# Altium project FlexLED.PrjPcb
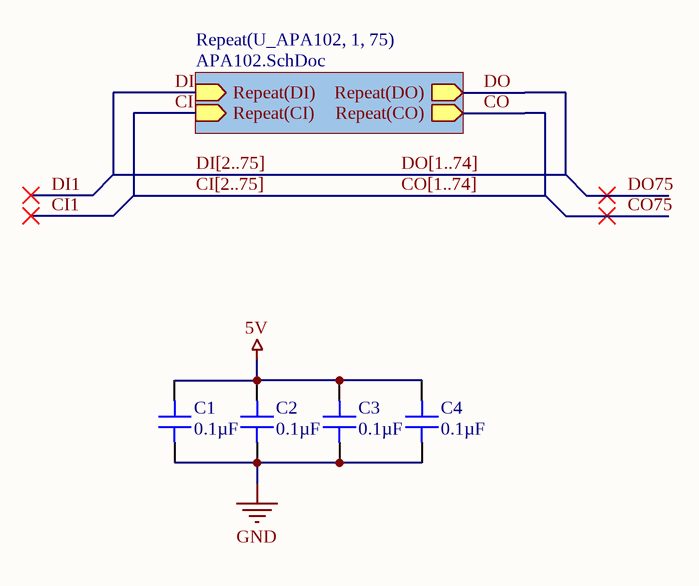
[diagram p0: top.SchDoc]
2 sheets, 79 parts. Net scope: hierarchical (ports join the sheet entries above them; power ports are global).
Board file: FlexLED.PcbDoc
Sheets:
  top.SchDoc
    U_APA1021 = APA102.SchDoc
    U_APA1022 = APA102.SchDoc
    U_APA1023 = APA102.SchDoc
    U_APA1024 = APA102.SchDoc
    U_APA1025 = APA102.SchDoc
    U_APA1026 = APA102.SchDoc
    U_APA1027 = APA102.SchDoc
    U_APA1028 = APA102.SchDoc
    U_APA1029 = APA102.SchDoc
    U_APA10210 = APA102.SchDoc
    U_APA10211 = APA102.SchDoc
    U_APA10212 = APA102.SchDoc
    U_APA10213 = APA102.SchDoc
    U_APA10214 = APA102.SchDoc
    U_APA10215 = APA102.SchDoc
    U_APA10216 = APA102.SchDoc
    U_APA10217 = APA102.SchDoc
    U_APA10218 = APA102.SchDoc
    U_APA10219 = APA102.SchDoc
    U_APA10220 = APA102.SchDoc
    U_APA10221 = APA102.SchDoc
    U_APA10222 = APA102.SchDoc
    U_APA10223 = APA102.SchDoc
    U_APA10224 = APA102.SchDoc
    U_APA10225 = APA102.SchDoc
    U_APA10226 = APA102.SchDoc
    U_APA10227 = APA102.SchDoc
    U_APA10228 = APA102.SchDoc
    U_APA10229 = APA102.SchDoc
    U_APA10230 = APA102.SchDoc
    U_APA10231 = APA102.SchDoc
    U_APA10232 = APA102.SchDoc
    U_APA10233 = APA102.SchDoc
    U_APA10234 = APA102.SchDoc
    U_APA10235 = APA102.SchDoc
    U_APA10236 = APA102.SchDoc
    U_APA10237 = APA102.SchDoc
    U_APA10238 = APA102.SchDoc
    U_APA10239 = APA102.SchDoc
    U_APA10240 = APA102.SchDoc
    U_APA10241 = APA102.SchDoc
    U_APA10242 = APA102.SchDoc
    U_APA10243 = APA102.SchDoc
    U_APA10244 = APA102.SchDoc
    U_APA10245 = APA102.SchDoc
    U_APA10246 = APA102.SchDoc
    U_APA10247 = APA102.SchDoc
    U_APA10248 = APA102.SchDoc
    U_APA10249 = APA102.SchDoc
    U_APA10250 = APA102.SchDoc
    U_APA10251 = APA102.SchDoc
    U_APA10252 = APA102.SchDoc
    U_APA10253 = APA102.SchDoc
    U_APA10254 = APA102.SchDoc
    U_APA10255 = APA102.SchDoc
    U_APA10256 = APA102.SchDoc
    U_APA10257 = APA102.SchDoc
    U_APA10258 = APA102.SchDoc
    U_APA10259 = APA102.SchDoc
    U_APA10260 = APA102.SchDoc
    U_APA10261 = APA102.SchDoc
    U_APA10262 = APA102.SchDoc
    U_APA10263 = APA102.SchDoc
    U_APA10264 = APA102.SchDoc
    U_APA10265 = APA102.SchDoc
    U_APA10266 = APA102.SchDoc
    U_APA10267 = APA102.SchDoc
    U_APA10268 = APA102.SchDoc
    U_APA10269 = APA102.SchDoc
    U_APA10270 = APA102.SchDoc
    U_APA10271 = APA102.SchDoc
    U_APA10272 = APA102.SchDoc
    U_APA10273 = APA102.SchDoc
    U_APA10274 = APA102.SchDoc
    U_APA10275 = APA102.SchDoc

## Sheet top.SchDoc
size A

### Parts
C1  0.1µF  [CAP 0402_1005]
C2  0.1µF  [CAP 0402_1005]
C3  0.1µF  [CAP 0402_1005]
C4  0.1µF  [CAP 0402_1005]

### Sub-sheets
Repeat(U_APA102, 1, 75) = APA102.SchDoc: Repeat(DI) (in), Repeat(CI) (in), Repeat(CO) (out), Repeat(DO) (out)

### Nets
5V: C1.2 C2.2 C3.2 C4.2
GND: C1.1 C2.1 C3.1 C4.1
CI: sheet Repeat(U_APA102, 1, 75)/Repeat(CI)
CO: sheet Repeat(U_APA102, 1, 75)/Repeat(CO)
DI: sheet Repeat(U_APA102, 1, 75)/Repeat(DI)
DO: sheet Repeat(U_APA102, 1, 75)/Repeat(DO)

### Buses and harness runs
bus CI[2..75] = CO[1..74]
bus DI[2..75] = DO[1..74]

### Library data of the parts
C1-C4 = VJ0402V104ZXJCW1BC: CAP CER 0.1UF 16V Y5V 0402; Manufacturer: Vishay Vitramon; Temperature Coefficient: Y5V (F); Tolerance: -20%, +80%; Part Number: VJ0402V104ZXJCW1BC; Value: 0.1µF; Applications: General Purpose; Capacitance: 0.1µF; ComponentLink1Description: Datasheet; ComponentLink1URL: https://www.vishay.com/docs/28548/vjw1bcbascomseries.pdf; ComponentLink2Description: DigiKey Link; ComponentLink2URL: http://digikey.com/product-detail/en/vishay-vitramon/VJ0402V104ZXJCW1BC/720-1523-1-ND/420979; Device Package: 0402 (1005 Metric); LastUpdated: 9/2/2020 1:01:27 AM; Lifecycle Status: Active; Minimum Order: 1; Mounting Type: Surface Mount, MLCC; Operating Temperature: -30°C ~ 85°C; Package / Case: 0402 (1005 Metric); Packaging: TapeAndReel; PartId: 12979; Part Status: Active; Price: 0.01; Series: VJ; Size / Dimension: 0.039" L x 0.020" W (1.00mm x 0.50mm); Supplier 1: DigiKey; Supplier Part Number 1: 720-1523-1-ND; Thickness (Max): 0.022" (0.55mm); Voltage - Rated: 16V

## Sheet APA102.SchDoc
size A
Used 75 times, as channels U_APA1021, U_APA1022, U_APA1023, U_APA1024, U_APA1025, U_APA1026, U_APA1027, U_APA1028, U_APA1029, U_APA10210, U_APA10211, U_APA10212, U_APA10213, U_APA10214, U_APA10215, U_APA10216, U_APA10217, U_APA10218, U_APA10219, U_APA10220, U_APA10221, U_APA10222, U_APA10223, U_APA10224, U_APA10225, U_APA10226, U_APA10227, U_APA10228, U_APA10229, U_APA10230, U_APA10231, U_APA10232, U_APA10233, U_APA10234, U_APA10235, U_APA10236, U_APA10237, U_APA10238, U_APA10239, U_APA10240, U_APA10241, U_APA10242, U_APA10243, U_APA10244, U_APA10245, U_APA10246, U_APA10247, U_APA10248, U_APA10249, U_APA10250, U_APA10251, U_APA10252, U_APA10253, U_APA10254, U_APA10255, U_APA10256, U_APA10257, U_APA10258, U_APA10259, U_APA10260, U_APA10261, U_APA10262, U_APA10263, U_APA10264, U_APA10265, U_APA10266, U_APA10267, U_APA10268, U_APA10269, U_APA10270, U_APA10271, U_APA10272, U_APA10273, U_APA10274, U_APA10275. Parts and nets are listed once, with the designators drawn on the sheet.
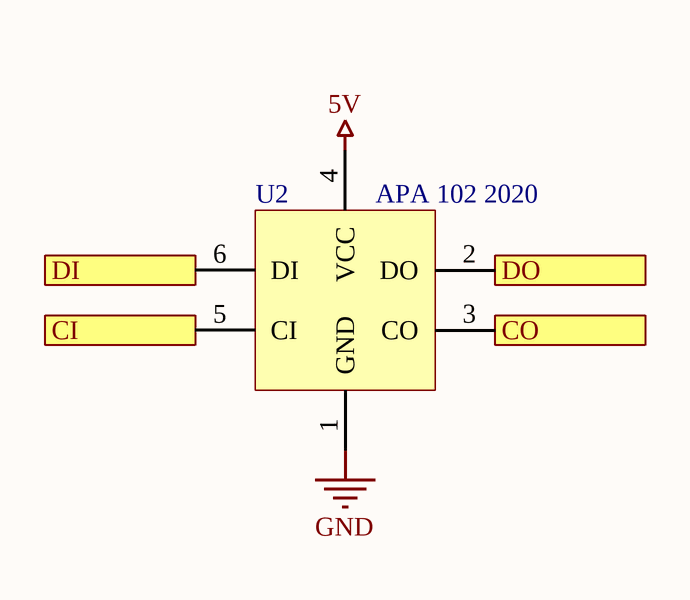
[diagram p1: APA102.SchDoc]

### Parts
U2  APA 102 2020  [LED_APA-102-1515]

### Ports
CI (in), CO (out), DI (in), DO (out)

### Nets
5V: U2.4(VCC)
GND: U2.1(GND)
CI: U2.5(CI) ; port CI
CO: U2.3(CO) ; port CO
DI: U2.6(DI) ; port DI
DO: U2.2(DO) ; port DO

### Channels
U_APA1021: designators end in _1; ports CI=CI1 CO=CI2 DI=DI1 DO=DI2
U_APA1022: designators end in _2; ports CI=CI2 CO=CI3 DI=DI2 DO=DI3
U_APA1023: designators end in _3; ports CI=CI3 CO=CI4 DI=DI3 DO=DI4
U_APA1024: designators end in _4; ports CI=CI4 CO=CI5 DI=DI4 DO=DI5
U_APA1025: designators end in _5; ports CI=CI5 CO=CI6 DI=DI5 DO=DI6
U_APA1026: designators end in _6; ports CI=CI6 CO=CI7 DI=DI6 DO=DI7
U_APA1027: designators end in _7; ports CI=CI7 CO=CI8 DI=DI7 DO=DI8
U_APA1028: designators end in _8; ports CI=CI8 CO=CI9 DI=DI8 DO=DI9
U_APA1029: designators end in _9; ports CI=CI9 CO=CI10 DI=DI9 DO=DI10
U_APA10210: designators end in _10; ports CI=CI10 CO=CI11 DI=DI10 DO=DI11
U_APA10211: designators end in _11; ports CI=CI11 CO=CI12 DI=DI11 DO=DI12
U_APA10212: designators end in _12; ports CI=CI12 CO=CI13 DI=DI12 DO=DI13
U_APA10213: designators end in _13; ports CI=CI13 CO=CI14 DI=DI13 DO=DI14
U_APA10214: designators end in _14; ports CI=CI14 CO=CI15 DI=DI14 DO=DI15
U_APA10215: designators end in _15; ports CI=CI15 CO=CI16 DI=DI15 DO=DI16
U_APA10216: designators end in _16; ports CI=CI16 CO=CI17 DI=DI16 DO=DI17
U_APA10217: designators end in _17; ports CI=CI17 CO=CI18 DI=DI17 DO=DI18
U_APA10218: designators end in _18; ports CI=CI18 CO=CI19 DI=DI18 DO=DI19
U_APA10219: designators end in _19; ports CI=CI19 CO=CI20 DI=DI19 DO=DI20
U_APA10220: designators end in _20; ports CI=CI20 CO=CI21 DI=DI20 DO=DI21
U_APA10221: designators end in _21; ports CI=CI21 CO=CI22 DI=DI21 DO=DI22
U_APA10222: designators end in _22; ports CI=CI22 CO=CI23 DI=DI22 DO=DI23
U_APA10223: designators end in _23; ports CI=CI23 CO=CI24 DI=DI23 DO=DI24
U_APA10224: designators end in _24; ports CI=CI24 CO=CI25 DI=DI24 DO=DI25
U_APA10225: designators end in _25; ports CI=CI25 CO=CI26 DI=DI25 DO=DI26
U_APA10226: designators end in _26; ports CI=CI26 CO=CI27 DI=DI26 DO=DI27
U_APA10227: designators end in _27; ports CI=CI27 CO=CI28 DI=DI27 DO=DI28
U_APA10228: designators end in _28; ports CI=CI28 CO=CI29 DI=DI28 DO=DI29
U_APA10229: designators end in _29; ports CI=CI29 CO=CI30 DI=DI29 DO=DI30
U_APA10230: designators end in _30; ports CI=CI30 CO=CI31 DI=DI30 DO=DI31
U_APA10231: designators end in _31; ports CI=CI31 CO=CI32 DI=DI31 DO=DI32
U_APA10232: designators end in _32; ports CI=CI32 CO=CI33 DI=DI32 DO=DI33
U_APA10233: designators end in _33; ports CI=CI33 CO=CI34 DI=DI33 DO=DI34
U_APA10234: designators end in _34; ports CI=CI34 CO=CI35 DI=DI34 DO=DI35
U_APA10235: designators end in _35; ports CI=CI35 CO=CI36 DI=DI35 DO=DI36
U_APA10236: designators end in _36; ports CI=CI36 CO=CI37 DI=DI36 DO=DI37
U_APA10237: designators end in _37; ports CI=CI37 CO=CI38 DI=DI37 DO=DI38
U_APA10238: designators end in _38; ports CI=CI38 CO=CI39 DI=DI38 DO=DI39
U_APA10239: designators end in _39; ports CI=CI39 CO=CI40 DI=DI39 DO=DI40
U_APA10240: designators end in _40; ports CI=CI40 CO=CI41 DI=DI40 DO=DI41
U_APA10241: designators end in _41; ports CI=CI41 CO=CI42 DI=DI41 DO=DI42
U_APA10242: designators end in _42; ports CI=CI42 CO=CI43 DI=DI42 DO=DI43
U_APA10243: designators end in _43; ports CI=CI43 CO=CI44 DI=DI43 DO=DI44
U_APA10244: designators end in _44; ports CI=CI44 CO=CI45 DI=DI44 DO=DI45
U_APA10245: designators end in _45; ports CI=CI45 CO=CI46 DI=DI45 DO=DI46
U_APA10246: designators end in _46; ports CI=CI46 CO=CI47 DI=DI46 DO=DI47
U_APA10247: designators end in _47; ports CI=CI47 CO=CI48 DI=DI47 DO=DI48
U_APA10248: designators end in _48; ports CI=CI48 CO=CI49 DI=DI48 DO=DI49
U_APA10249: designators end in _49; ports CI=CI49 CO=CI50 DI=DI49 DO=DI50
U_APA10250: designators end in _50; ports CI=CI50 CO=CI51 DI=DI50 DO=DI51
U_APA10251: designators end in _51; ports CI=CI51 CO=CI52 DI=DI51 DO=DI52
U_APA10252: designators end in _52; ports CI=CI52 CO=CI53 DI=DI52 DO=DI53
U_APA10253: designators end in _53; ports CI=CI53 CO=CI54 DI=DI53 DO=DI54
U_APA10254: designators end in _54; ports CI=CI54 CO=CI55 DI=DI54 DO=DI55
U_APA10255: designators end in _55; ports CI=CI55 CO=CI56 DI=DI55 DO=DI56
U_APA10256: designators end in _56; ports CI=CI56 CO=CI57 DI=DI56 DO=DI57
U_APA10257: designators end in _57; ports CI=CI57 CO=CI58 DI=DI57 DO=DI58
U_APA10258: designators end in _58; ports CI=CI58 CO=CI59 DI=DI58 DO=DI59
U_APA10259: designators end in _59; ports CI=CI59 CO=CI60 DI=DI59 DO=DI60
U_APA10260: designators end in _60; ports CI=CI60 CO=CI61 DI=DI60 DO=DI61
U_APA10261: designators end in _61; ports CI=CI61 CO=CI62 DI=DI61 DO=DI62
U_APA10262: designators end in _62; ports CI=CI62 CO=CI63 DI=DI62 DO=DI63
U_APA10263: designators end in _63; ports CI=CI63 CO=CI64 DI=DI63 DO=DI64
U_APA10264: designators end in _64; ports CI=CI64 CO=CI65 DI=DI64 DO=DI65
U_APA10265: designators end in _65; ports CI=CI65 CO=CI66 DI=DI65 DO=DI66
U_APA10266: designators end in _66; ports CI=CI66 CO=CI67 DI=DI66 DO=DI67
U_APA10267: designators end in _67; ports CI=CI67 CO=CI68 DI=DI67 DO=DI68
U_APA10268: designators end in _68; ports CI=CI68 CO=CI69 DI=DI68 DO=DI69
U_APA10269: designators end in _69; ports CI=CI69 CO=CI70 DI=DI69 DO=DI70
U_APA10270: designators end in _70; ports CI=CI70 CO=CI71 DI=DI70 DO=DI71
U_APA10271: designators end in _71; ports CI=CI71 CO=CI72 DI=DI71 DO=DI72
U_APA10272: designators end in _72; ports CI=CI72 CO=CI73 DI=DI72 DO=DI73
U_APA10273: designators end in _73; ports CI=CI73 CO=CI74 DI=DI73 DO=DI74
U_APA10274: designators end in _74; ports CI=CI74 CO=CI75 DI=DI74 DO=DI75
U_APA10275: designators end in _75; ports CI=CI75 CO=CO75 DI=DI75 DO=DO75

### Library data of the parts
U2 = APA-102-1515: 8-pin type LED three-color RGB Dimming control; MP: APA-102-2020-256-8; MF: iPixel LED Light Co.; Value: *; SnapEDA_Link: https://www.snapeda.com/parts/APA-102-2020-256-8/iPixel%20LED%20Light%20Co./view-part/698331/?ref=snap; Availability: Unavailable; Package: SMD-8 iPixel LED Light Co.; Price: None

## Nets that join several sheets
5V: top (C1.2 C2.2 C3.2 C4.2), U_APA1021 (U2_1.4), U_APA1022 (U2_2.4), U_APA1023 (U2_3.4), U_APA1024 (U2_4.4), U_APA1025 (U2_5.4), U_APA1026 (U2_6.4), U_APA1027 (U2_7.4), U_APA1028 (U2_8.4), U_APA1029 (U2_9.4), U_APA10210 (U2_10.4), U_APA10211 (U2_11.4), U_APA10212 (U2_12.4), U_APA10213 (U2_13.4), U_APA10214 (U2_14.4), U_APA10215 (U2_15.4), U_APA10216 (U2_16.4), U_APA10217 (U2_17.4), U_APA10218 (U2_18.4), U_APA10219 (U2_19.4), U_APA10220 (U2_20.4), U_APA10221 (U2_21.4), U_APA10222 (U2_22.4), U_APA10223 (U2_23.4), U_APA10224 (U2_24.4), U_APA10225 (U2_25.4), U_APA10226 (U2_26.4), U_APA10227 (U2_27.4), U_APA10228 (U2_28.4), U_APA10229 (U2_29.4), U_APA10230 (U2_30.4), U_APA10231 (U2_31.4), U_APA10232 (U2_32.4), U_APA10233 (U2_33.4), U_APA10234 (U2_34.4), U_APA10235 (U2_35.4), U_APA10236 (U2_36.4), U_APA10237 (U2_37.4), U_APA10238 (U2_38.4), U_APA10239 (U2_39.4), U_APA10240 (U2_40.4), U_APA10241 (U2_41.4), U_APA10242 (U2_42.4), U_APA10243 (U2_43.4), U_APA10244 (U2_44.4), U_APA10245 (U2_45.4), U_APA10246 (U2_46.4), U_APA10247 (U2_47.4), U_APA10248 (U2_48.4), U_APA10249 (U2_49.4), U_APA10250 (U2_50.4), U_APA10251 (U2_51.4), U_APA10252 (U2_52.4), U_APA10253 (U2_53.4), U_APA10254 (U2_54.4), U_APA10255 (U2_55.4), U_APA10256 (U2_56.4), U_APA10257 (U2_57.4), U_APA10258 (U2_58.4), U_APA10259 (U2_59.4), U_APA10260 (U2_60.4), U_APA10261 (U2_61.4), U_APA10262 (U2_62.4), U_APA10263 (U2_63.4), U_APA10264 (U2_64.4), U_APA10265 (U2_65.4), U_APA10266 (U2_66.4), U_APA10267 (U2_67.4), U_APA10268 (U2_68.4), U_APA10269 (U2_69.4), U_APA10270 (U2_70.4), U_APA10271 (U2_71.4), U_APA10272 (U2_72.4), U_APA10273 (U2_73.4), U_APA10274 (U2_74.4), U_APA10275 (U2_75.4)
GND: top (C1.1 C2.1 C3.1 C4.1), U_APA1021 (U2_1.1), U_APA1022 (U2_2.1), U_APA1023 (U2_3.1), U_APA1024 (U2_4.1), U_APA1025 (U2_5.1), U_APA1026 (U2_6.1), U_APA1027 (U2_7.1), U_APA1028 (U2_8.1), U_APA1029 (U2_9.1), U_APA10210 (U2_10.1), U_APA10211 (U2_11.1), U_APA10212 (U2_12.1), U_APA10213 (U2_13.1), U_APA10214 (U2_14.1), U_APA10215 (U2_15.1), U_APA10216 (U2_16.1), U_APA10217 (U2_17.1), U_APA10218 (U2_18.1), U_APA10219 (U2_19.1), U_APA10220 (U2_20.1), U_APA10221 (U2_21.1), U_APA10222 (U2_22.1), U_APA10223 (U2_23.1), U_APA10224 (U2_24.1), U_APA10225 (U2_25.1), U_APA10226 (U2_26.1), U_APA10227 (U2_27.1), U_APA10228 (U2_28.1), U_APA10229 (U2_29.1), U_APA10230 (U2_30.1), U_APA10231 (U2_31.1), U_APA10232 (U2_32.1), U_APA10233 (U2_33.1), U_APA10234 (U2_34.1), U_APA10235 (U2_35.1), U_APA10236 (U2_36.1), U_APA10237 (U2_37.1), U_APA10238 (U2_38.1), U_APA10239 (U2_39.1), U_APA10240 (U2_40.1), U_APA10241 (U2_41.1), U_APA10242 (U2_42.1), U_APA10243 (U2_43.1), U_APA10244 (U2_44.1), U_APA10245 (U2_45.1), U_APA10246 (U2_46.1), U_APA10247 (U2_47.1), U_APA10248 (U2_48.1), U_APA10249 (U2_49.1), U_APA10250 (U2_50.1), U_APA10251 (U2_51.1), U_APA10252 (U2_52.1), U_APA10253 (U2_53.1), U_APA10254 (U2_54.1), U_APA10255 (U2_55.1), U_APA10256 (U2_56.1), U_APA10257 (U2_57.1), U_APA10258 (U2_58.1), U_APA10259 (U2_59.1), U_APA10260 (U2_60.1), U_APA10261 (U2_61.1), U_APA10262 (U2_62.1), U_APA10263 (U2_63.1), U_APA10264 (U2_64.1), U_APA10265 (U2_65.1), U_APA10266 (U2_66.1), U_APA10267 (U2_67.1), U_APA10268 (U2_68.1), U_APA10269 (U2_69.1), U_APA10270 (U2_70.1), U_APA10271 (U2_71.1), U_APA10272 (U2_72.1), U_APA10273 (U2_73.1), U_APA10274 (U2_74.1), U_APA10275 (U2_75.1)
CI2: U_APA1021 (U2_1.3), U_APA1022 (U2_2.5)
CI3: U_APA1022 (U2_2.3), U_APA1023 (U2_3.5)
CI4: U_APA1023 (U2_3.3), U_APA1024 (U2_4.5)
CI5: U_APA1024 (U2_4.3), U_APA1025 (U2_5.5)
CI6: U_APA1025 (U2_5.3), U_APA1026 (U2_6.5)
CI7: U_APA1026 (U2_6.3), U_APA1027 (U2_7.5)
CI8: U_APA1027 (U2_7.3), U_APA1028 (U2_8.5)
CI9: U_APA1028 (U2_8.3), U_APA1029 (U2_9.5)
CI10: U_APA1029 (U2_9.3), U_APA10210 (U2_10.5)
CI11: U_APA10210 (U2_10.3), U_APA10211 (U2_11.5)
CI12: U_APA10211 (U2_11.3), U_APA10212 (U2_12.5)
CI13: U_APA10212 (U2_12.3), U_APA10213 (U2_13.5)
CI14: U_APA10213 (U2_13.3), U_APA10214 (U2_14.5)
CI15: U_APA10214 (U2_14.3), U_APA10215 (U2_15.5)
CI16: U_APA10215 (U2_15.3), U_APA10216 (U2_16.5)
CI17: U_APA10216 (U2_16.3), U_APA10217 (U2_17.5)
CI18: U_APA10217 (U2_17.3), U_APA10218 (U2_18.5)
CI19: U_APA10218 (U2_18.3), U_APA10219 (U2_19.5)
CI20: U_APA10219 (U2_19.3), U_APA10220 (U2_20.5)
CI21: U_APA10220 (U2_20.3), U_APA10221 (U2_21.5)
CI22: U_APA10221 (U2_21.3), U_APA10222 (U2_22.5)
CI23: U_APA10222 (U2_22.3), U_APA10223 (U2_23.5)
CI24: U_APA10223 (U2_23.3), U_APA10224 (U2_24.5)
CI25: U_APA10224 (U2_24.3), U_APA10225 (U2_25.5)
CI26: U_APA10225 (U2_25.3), U_APA10226 (U2_26.5)
CI27: U_APA10226 (U2_26.3), U_APA10227 (U2_27.5)
CI28: U_APA10227 (U2_27.3), U_APA10228 (U2_28.5)
CI29: U_APA10228 (U2_28.3), U_APA10229 (U2_29.5)
CI30: U_APA10229 (U2_29.3), U_APA10230 (U2_30.5)
CI31: U_APA10230 (U2_30.3), U_APA10231 (U2_31.5)
CI32: U_APA10231 (U2_31.3), U_APA10232 (U2_32.5)
CI33: U_APA10232 (U2_32.3), U_APA10233 (U2_33.5)
CI34: U_APA10233 (U2_33.3), U_APA10234 (U2_34.5)
CI35: U_APA10234 (U2_34.3), U_APA10235 (U2_35.5)
CI36: U_APA10235 (U2_35.3), U_APA10236 (U2_36.5)
CI37: U_APA10236 (U2_36.3), U_APA10237 (U2_37.5)
CI38: U_APA10237 (U2_37.3), U_APA10238 (U2_38.5)
CI39: U_APA10238 (U2_38.3), U_APA10239 (U2_39.5)
CI40: U_APA10239 (U2_39.3), U_APA10240 (U2_40.5)
CI41: U_APA10240 (U2_40.3), U_APA10241 (U2_41.5)
CI42: U_APA10241 (U2_41.3), U_APA10242 (U2_42.5)
CI43: U_APA10242 (U2_42.3), U_APA10243 (U2_43.5)
CI44: U_APA10243 (U2_43.3), U_APA10244 (U2_44.5)
CI45: U_APA10244 (U2_44.3), U_APA10245 (U2_45.5)
CI46: U_APA10245 (U2_45.3), U_APA10246 (U2_46.5)
CI47: U_APA10246 (U2_46.3), U_APA10247 (U2_47.5)
CI48: U_APA10247 (U2_47.3), U_APA10248 (U2_48.5)
CI49: U_APA10248 (U2_48.3), U_APA10249 (U2_49.5)
CI50: U_APA10249 (U2_49.3), U_APA10250 (U2_50.5)
CI51: U_APA10250 (U2_50.3), U_APA10251 (U2_51.5)
CI52: U_APA10251 (U2_51.3), U_APA10252 (U2_52.5)
CI53: U_APA10252 (U2_52.3), U_APA10253 (U2_53.5)
CI54: U_APA10253 (U2_53.3), U_APA10254 (U2_54.5)
CI55: U_APA10254 (U2_54.3), U_APA10255 (U2_55.5)
CI56: U_APA10255 (U2_55.3), U_APA10256 (U2_56.5)
CI57: U_APA10256 (U2_56.3), U_APA10257 (U2_57.5)
CI58: U_APA10257 (U2_57.3), U_APA10258 (U2_58.5)
CI59: U_APA10258 (U2_58.3), U_APA10259 (U2_59.5)
CI60: U_APA10259 (U2_59.3), U_APA10260 (U2_60.5)
CI61: U_APA10260 (U2_60.3), U_APA10261 (U2_61.5)
CI62: U_APA10261 (U2_61.3), U_APA10262 (U2_62.5)
CI63: U_APA10262 (U2_62.3), U_APA10263 (U2_63.5)
CI64: U_APA10263 (U2_63.3), U_APA10264 (U2_64.5)
CI65: U_APA10264 (U2_64.3), U_APA10265 (U2_65.5)
CI66: U_APA10265 (U2_65.3), U_APA10266 (U2_66.5)
CI67: U_APA10266 (U2_66.3), U_APA10267 (U2_67.5)
CI68: U_APA10267 (U2_67.3), U_APA10268 (U2_68.5)
CI69: U_APA10268 (U2_68.3), U_APA10269 (U2_69.5)
CI70: U_APA10269 (U2_69.3), U_APA10270 (U2_70.5)
CI71: U_APA10270 (U2_70.3), U_APA10271 (U2_71.5)
CI72: U_APA10271 (U2_71.3), U_APA10272 (U2_72.5)
CI73: U_APA10272 (U2_72.3), U_APA10273 (U2_73.5)
CI74: U_APA10273 (U2_73.3), U_APA10274 (U2_74.5)
CI75: U_APA10274 (U2_74.3), U_APA10275 (U2_75.5)
DI2: U_APA1021 (U2_1.2), U_APA1022 (U2_2.6)
DI3: U_APA1022 (U2_2.2), U_APA1023 (U2_3.6)
DI4: U_APA1023 (U2_3.2), U_APA1024 (U2_4.6)
DI5: U_APA1024 (U2_4.2), U_APA1025 (U2_5.6)
DI6: U_APA1025 (U2_5.2), U_APA1026 (U2_6.6)
DI7: U_APA1026 (U2_6.2), U_APA1027 (U2_7.6)
DI8: U_APA1027 (U2_7.2), U_APA1028 (U2_8.6)
DI9: U_APA1028 (U2_8.2), U_APA1029 (U2_9.6)
DI10: U_APA1029 (U2_9.2), U_APA10210 (U2_10.6)
DI11: U_APA10210 (U2_10.2), U_APA10211 (U2_11.6)
DI12: U_APA10211 (U2_11.2), U_APA10212 (U2_12.6)
DI13: U_APA10212 (U2_12.2), U_APA10213 (U2_13.6)
DI14: U_APA10213 (U2_13.2), U_APA10214 (U2_14.6)
DI15: U_APA10214 (U2_14.2), U_APA10215 (U2_15.6)
DI16: U_APA10215 (U2_15.2), U_APA10216 (U2_16.6)
DI17: U_APA10216 (U2_16.2), U_APA10217 (U2_17.6)
DI18: U_APA10217 (U2_17.2), U_APA10218 (U2_18.6)
DI19: U_APA10218 (U2_18.2), U_APA10219 (U2_19.6)
DI20: U_APA10219 (U2_19.2), U_APA10220 (U2_20.6)
DI21: U_APA10220 (U2_20.2), U_APA10221 (U2_21.6)
DI22: U_APA10221 (U2_21.2), U_APA10222 (U2_22.6)
DI23: U_APA10222 (U2_22.2), U_APA10223 (U2_23.6)
DI24: U_APA10223 (U2_23.2), U_APA10224 (U2_24.6)
DI25: U_APA10224 (U2_24.2), U_APA10225 (U2_25.6)
DI26: U_APA10225 (U2_25.2), U_APA10226 (U2_26.6)
DI27: U_APA10226 (U2_26.2), U_APA10227 (U2_27.6)
DI28: U_APA10227 (U2_27.2), U_APA10228 (U2_28.6)
DI29: U_APA10228 (U2_28.2), U_APA10229 (U2_29.6)
DI30: U_APA10229 (U2_29.2), U_APA10230 (U2_30.6)
DI31: U_APA10230 (U2_30.2), U_APA10231 (U2_31.6)
DI32: U_APA10231 (U2_31.2), U_APA10232 (U2_32.6)
DI33: U_APA10232 (U2_32.2), U_APA10233 (U2_33.6)
DI34: U_APA10233 (U2_33.2), U_APA10234 (U2_34.6)
DI35: U_APA10234 (U2_34.2), U_APA10235 (U2_35.6)
DI36: U_APA10235 (U2_35.2), U_APA10236 (U2_36.6)
DI37: U_APA10236 (U2_36.2), U_APA10237 (U2_37.6)
DI38: U_APA10237 (U2_37.2), U_APA10238 (U2_38.6)
DI39: U_APA10238 (U2_38.2), U_APA10239 (U2_39.6)
DI40: U_APA10239 (U2_39.2), U_APA10240 (U2_40.6)
DI41: U_APA10240 (U2_40.2), U_APA10241 (U2_41.6)
DI42: U_APA10241 (U2_41.2), U_APA10242 (U2_42.6)
DI43: U_APA10242 (U2_42.2), U_APA10243 (U2_43.6)
DI44: U_APA10243 (U2_43.2), U_APA10244 (U2_44.6)
DI45: U_APA10244 (U2_44.2), U_APA10245 (U2_45.6)
DI46: U_APA10245 (U2_45.2), U_APA10246 (U2_46.6)
DI47: U_APA10246 (U2_46.2), U_APA10247 (U2_47.6)
DI48: U_APA10247 (U2_47.2), U_APA10248 (U2_48.6)
DI49: U_APA10248 (U2_48.2), U_APA10249 (U2_49.6)
DI50: U_APA10249 (U2_49.2), U_APA10250 (U2_50.6)
DI51: U_APA10250 (U2_50.2), U_APA10251 (U2_51.6)
DI52: U_APA10251 (U2_51.2), U_APA10252 (U2_52.6)
DI53: U_APA10252 (U2_52.2), U_APA10253 (U2_53.6)
DI54: U_APA10253 (U2_53.2), U_APA10254 (U2_54.6)
DI55: U_APA10254 (U2_54.2), U_APA10255 (U2_55.6)
DI56: U_APA10255 (U2_55.2), U_APA10256 (U2_56.6)
DI57: U_APA10256 (U2_56.2), U_APA10257 (U2_57.6)
DI58: U_APA10257 (U2_57.2), U_APA10258 (U2_58.6)
DI59: U_APA10258 (U2_58.2), U_APA10259 (U2_59.6)
DI60: U_APA10259 (U2_59.2), U_APA10260 (U2_60.6)
DI61: U_APA10260 (U2_60.2), U_APA10261 (U2_61.6)
DI62: U_APA10261 (U2_61.2), U_APA10262 (U2_62.6)
DI63: U_APA10262 (U2_62.2), U_APA10263 (U2_63.6)
DI64: U_APA10263 (U2_63.2), U_APA10264 (U2_64.6)
DI65: U_APA10264 (U2_64.2), U_APA10265 (U2_65.6)
DI66: U_APA10265 (U2_65.2), U_APA10266 (U2_66.6)
DI67: U_APA10266 (U2_66.2), U_APA10267 (U2_67.6)
DI68: U_APA10267 (U2_67.2), U_APA10268 (U2_68.6)
DI69: U_APA10268 (U2_68.2), U_APA10269 (U2_69.6)
DI70: U_APA10269 (U2_69.2), U_APA10270 (U2_70.6)
DI71: U_APA10270 (U2_70.2), U_APA10271 (U2_71.6)
DI72: U_APA10271 (U2_71.2), U_APA10272 (U2_72.6)
DI73: U_APA10272 (U2_72.2), U_APA10273 (U2_73.6)
DI74: U_APA10273 (U2_73.2), U_APA10274 (U2_74.6)
DI75: U_APA10274 (U2_74.2), U_APA10275 (U2_75.6)

## Assembly variants
Main: all parts fitted